# Altium project PowerMain_Ver0.1.PrjPcb
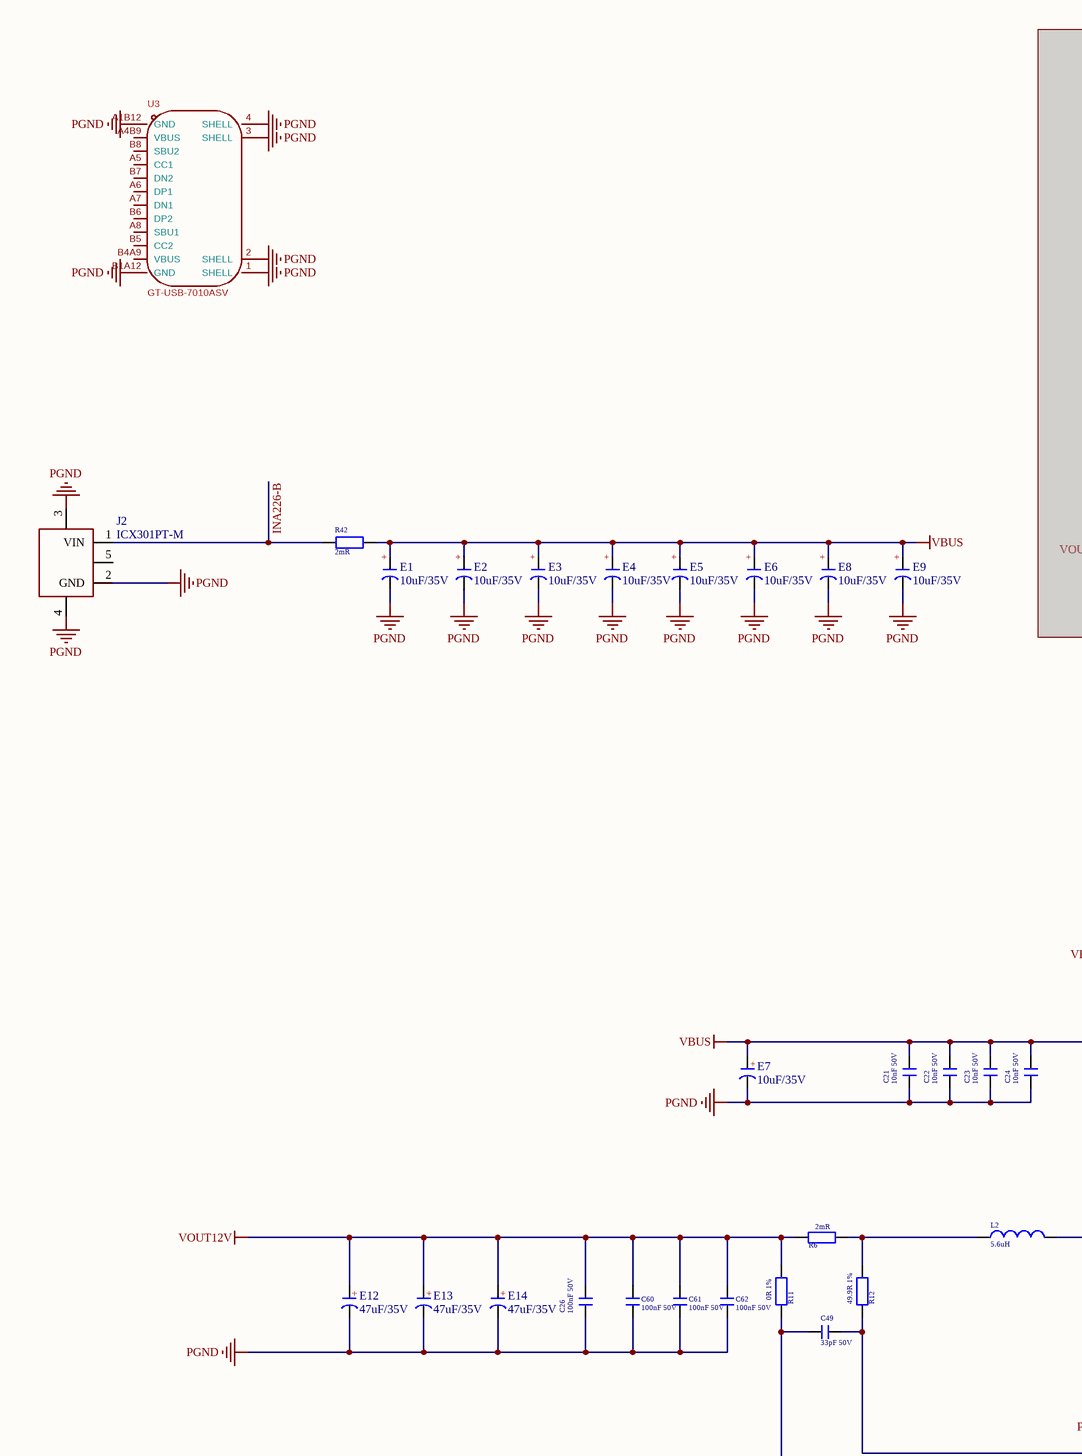
[diagram p0: LM5143.SchDoc, top left]
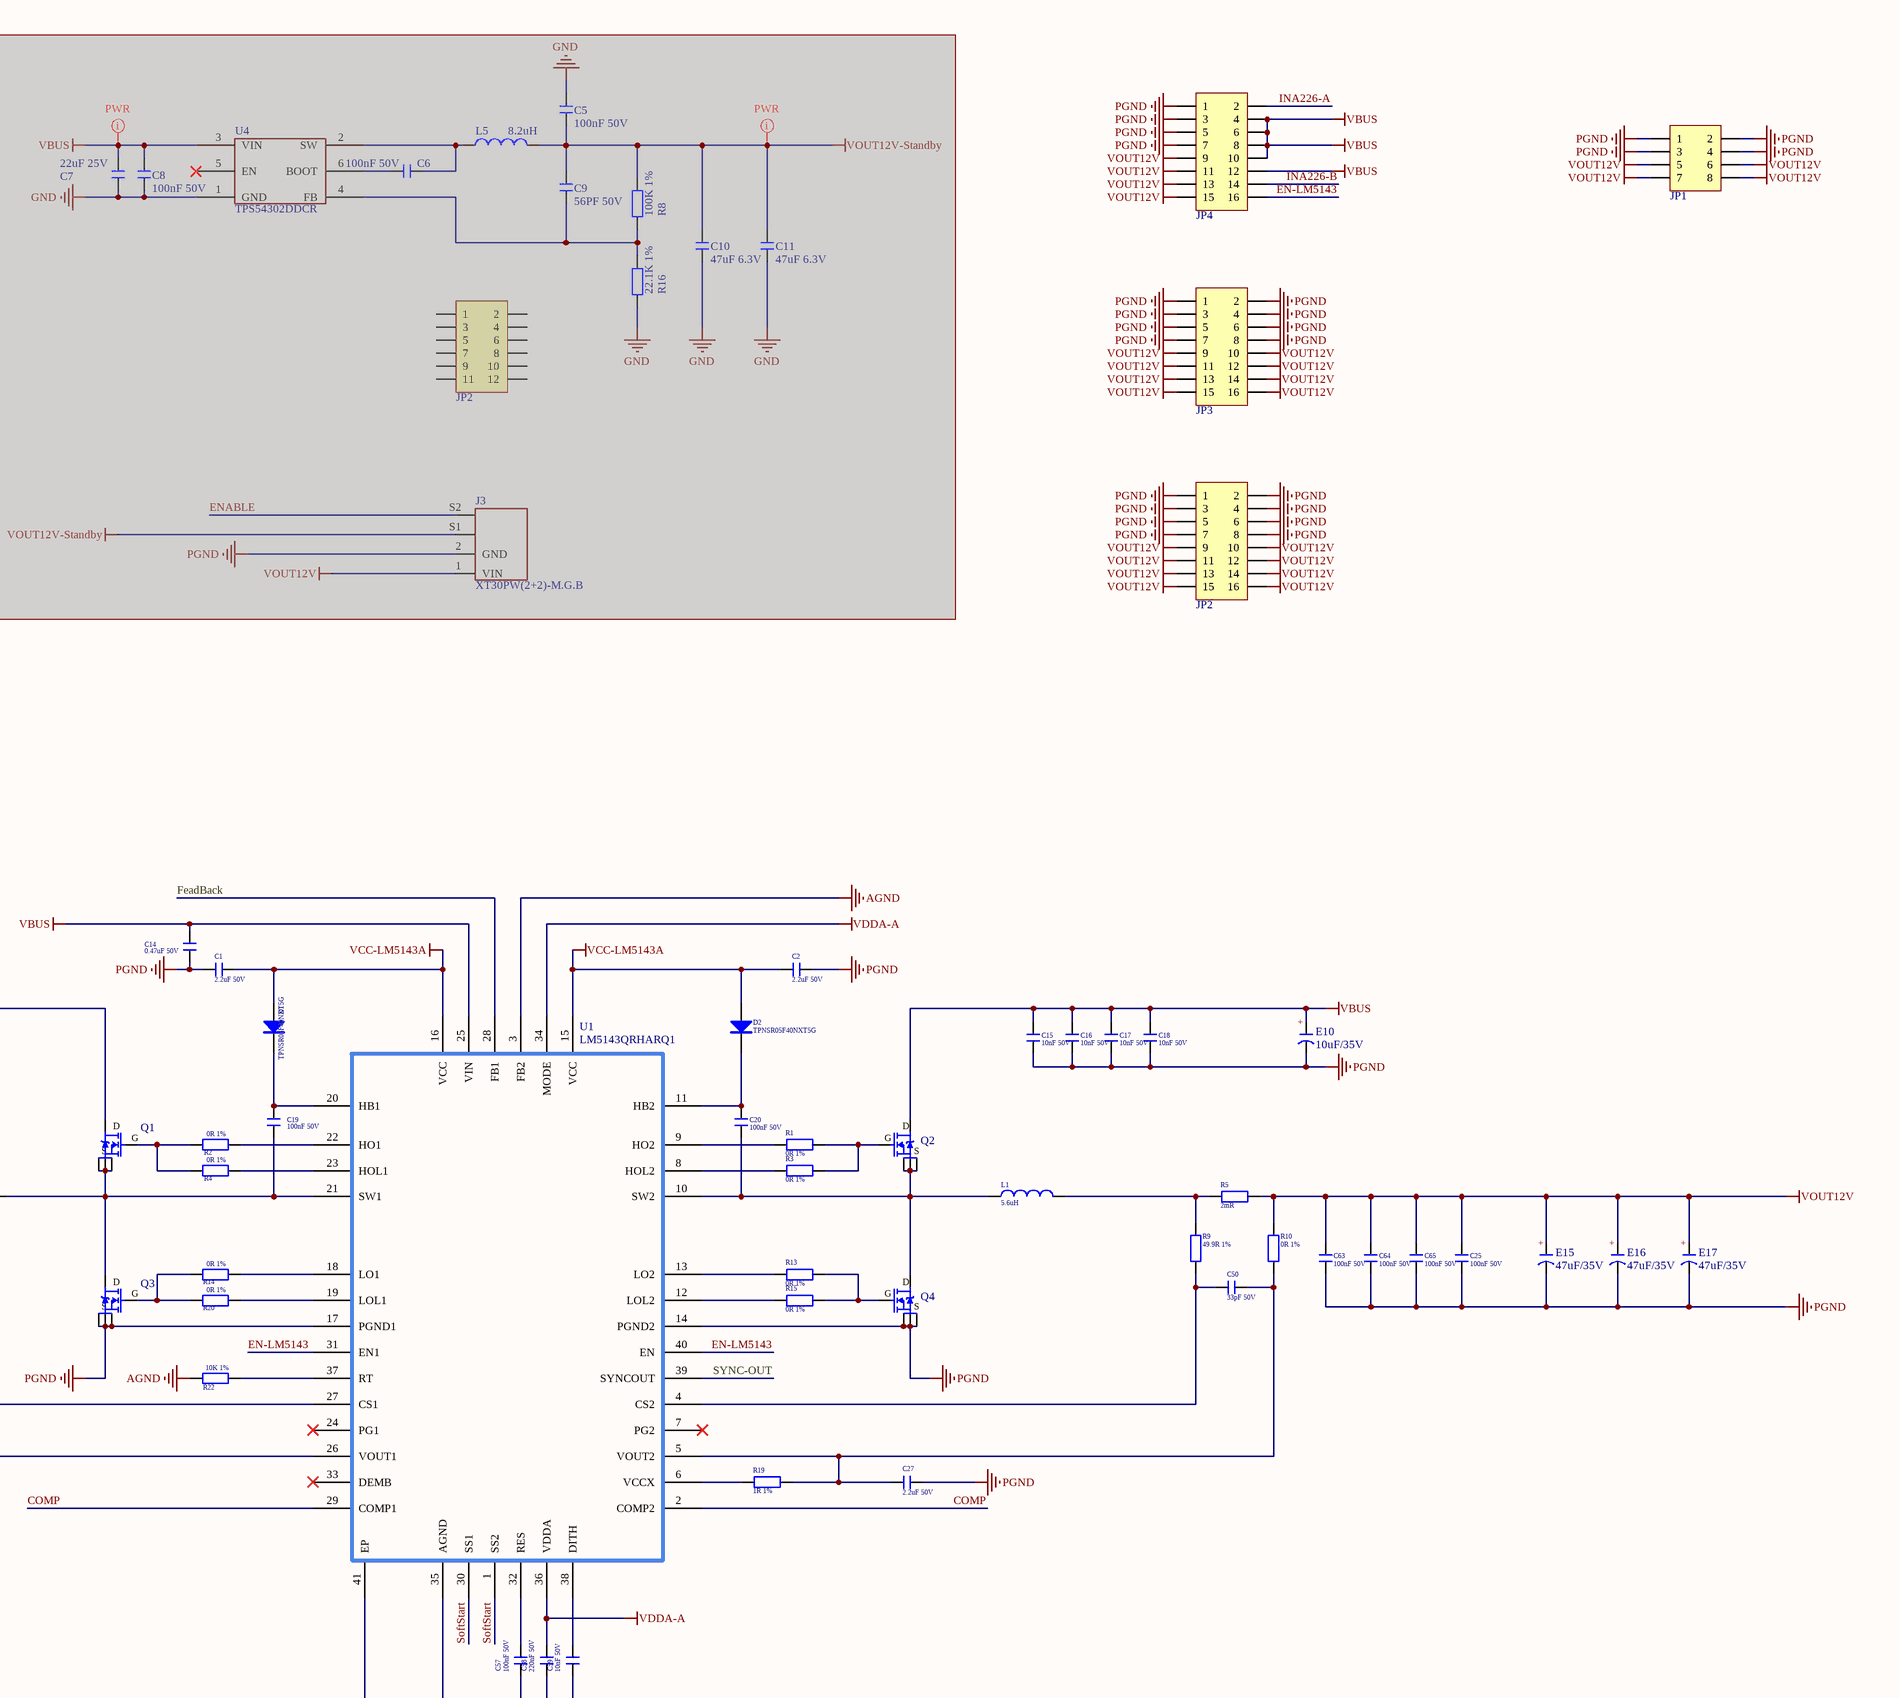
[diagram p1: LM5143.SchDoc, top right]
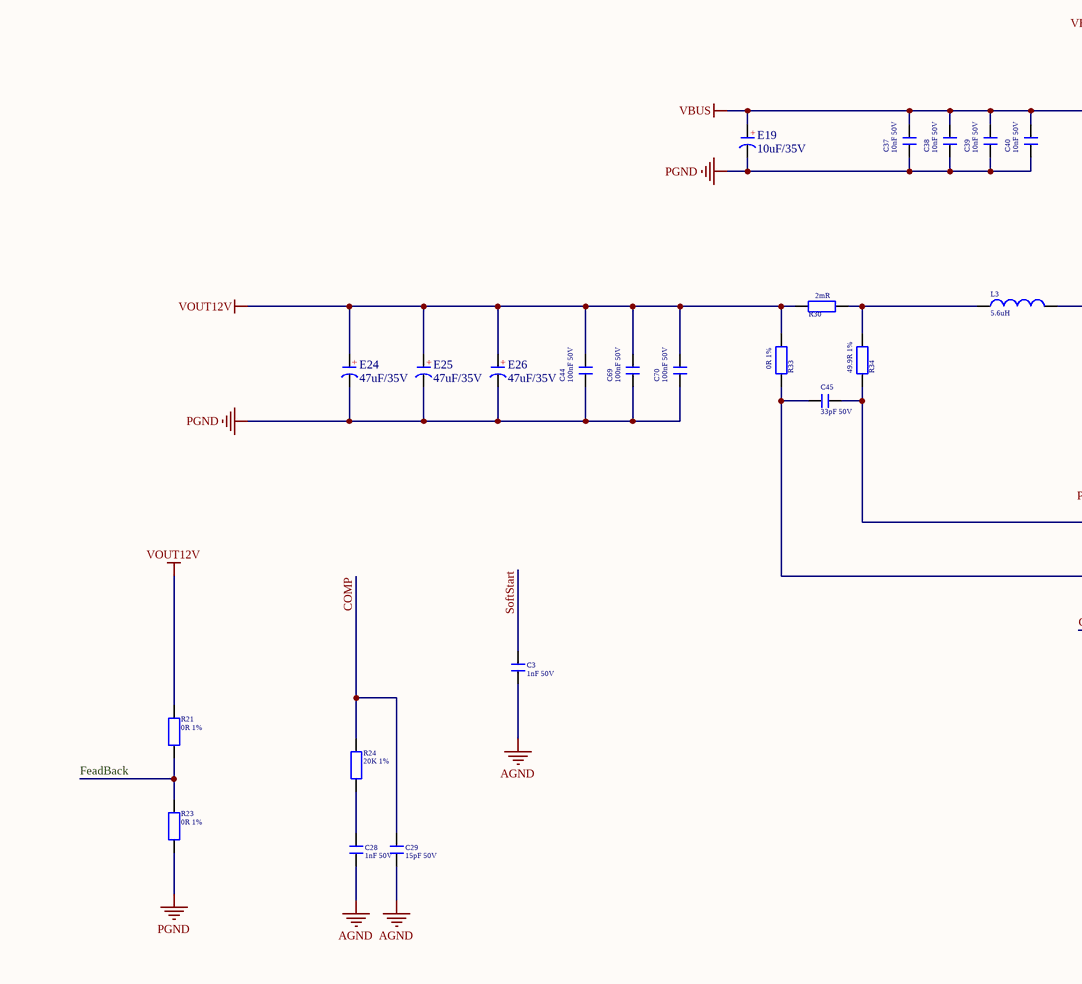
[diagram p2: LM5143.SchDoc, bottom left]
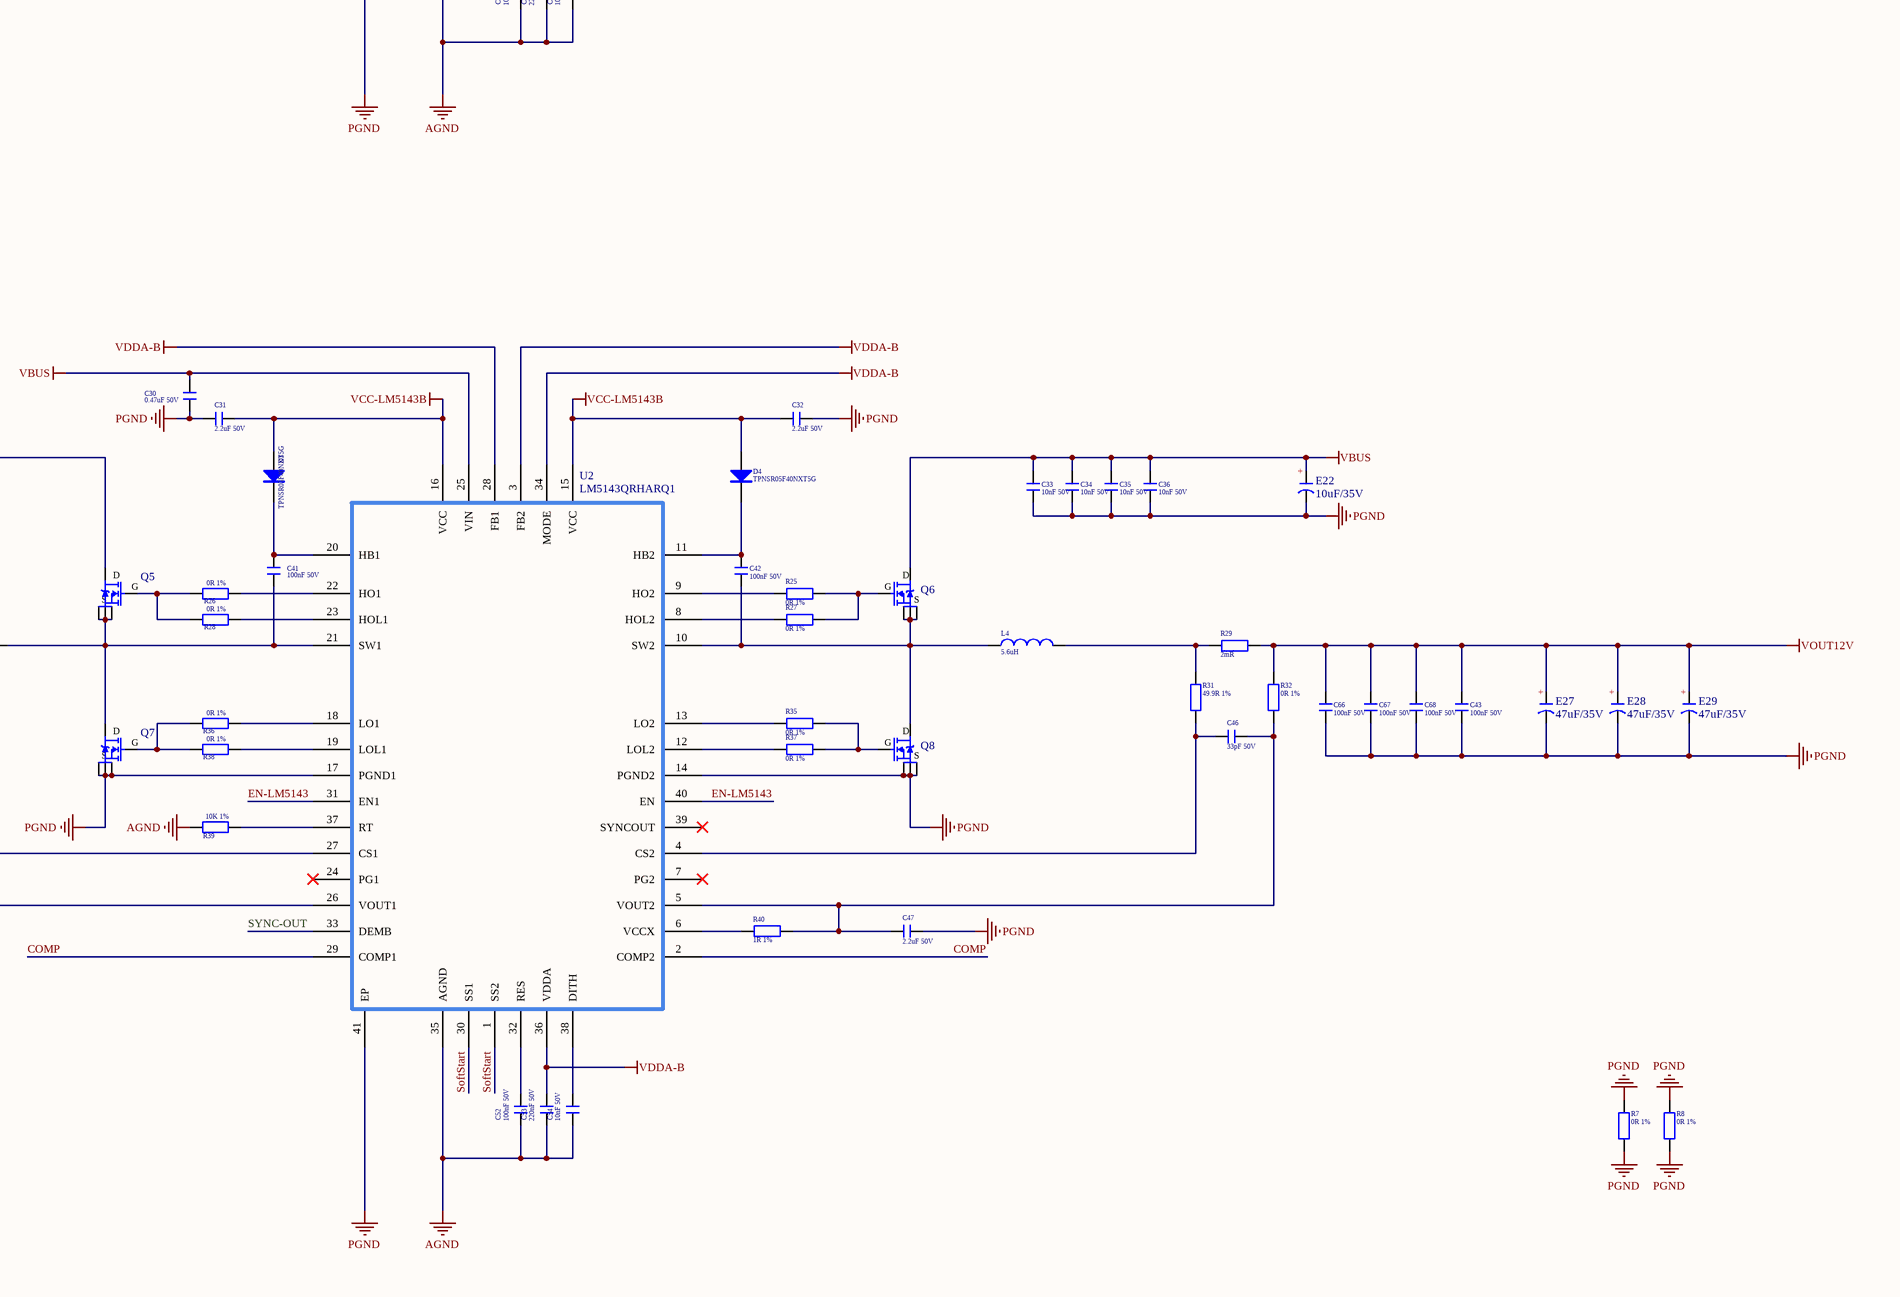
[diagram p3: LM5143.SchDoc, bottom right]
2 sheets, 155 parts. Net scope: global (net labels, ports and power ports of the same name join across sheets).
Board file: PCB.PcbDoc
Sheets:
  LM5143.SchDoc
  Sheet2.SchDoc

## Sheet LM5143.SchDoc
size 599 x 599 mm; SheetNumber: 1; SheetTotal: 2

### Parts
(Parts that share a designator on the sheet are numbered #1, #2 ... from top to bottom, then left to right.)
C1  2.2uF 50V  [C0402_l]
C2  2.2uF 50V  [C0402_l]
C3  1nF 50V  [C 0402_L]
C5  100nF 50V  [C0402_L]  (masked out: inside a compile mask, not in the netlist)
C6  100nF 50V  [C0402_L]  (masked out: inside a compile mask, not in the netlist)
C7  22uF 25V  [C0805_L]  (masked out: inside a compile mask, not in the netlist)
C8  100nF 50V  [C0402_L]  (masked out: inside a compile mask, not in the netlist)
C9  56PF 50V  [C0402_L]  (masked out: inside a compile mask, not in the netlist)
C10  47uF 6.3V  [C0805_L]  (masked out: inside a compile mask, not in the netlist)
C11  47uF 6.3V  [C0805_L]  (masked out: inside a compile mask, not in the netlist)
C14  0.47uF 50V  [C0402_l]
C15  10nF 50V  [C0603_l]
C16  10nF 50V  [C0603_l]
C17  10nF 50V  [C0603_l]
C18  10nF 50V  [C0603_l]
C19  100nF 50V  [C 0402_L]
C20  100nF 50V  [C 0402_L]
C21  10nF 50V  [C0603_l]
C22  10nF 50V  [C0603_l]
C23  10nF 50V  [C0603_l]
C24  10nF 50V  [C0603_l]
C25  100nF 50V  [C0402_l]
C26  100nF 50V  [C0603_l]
C27  2.2uF 50V  [C 0402_L]
C28  1nF 50V  [C 0402_L]
C29  15pF 50V  [C 0402_L]
C30  0.47uF 50V  [C0402_l]
C31  2.2uF 50V  [C0402_l]
C32  2.2uF 50V  [C0402_l]
C33  10nF 50V  [C0603_l]
C34  10nF 50V  [C0603_l]
C35  10nF 50V  [C0603_l]
C36  10nF 50V  [C0603_l]
C37  10nF 50V  [C0603_l]
C38  10nF 50V  [C0603_l]
C39  10nF 50V  [C0603_l]
C40  10nF 50V  [C0603_l]
C41  100nF 50V  [C 0402_L]
C42  100nF 50V  [C 0402_L]
C43  100nF 50V  [C0603_l]
C44  100nF 50V  [C0603_l]
C45  33pF 50V  [C0402_l]
C46  33pF 50V  [C0402_l]
C47  2.2uF 50V  [C 0402_L]
C49  33pF 50V  [C0402_l]
C50  33pF 50V  [C0402_l]
C52  100nF 50V  [C0402_l]
C53  220nF 50V  [C0402_l]
C54  10nF 50V  [C0402_l]
C57  100nF 50V  [C0402_l]
C58  220nF 50V  [C0402_l]
C59  10nF 50V  [C0402_l]
C60  100nF 50V  [C0603_l]
C61  100nF 50V  [C0402_l]
C62  100nF 50V  [C0603_l]
C63  100nF 50V  [C0603_l]
C64  100nF 50V  [C0603_l]
C65  100nF 50V  [C0603_l]
C66  100nF 50V  [C0402_l]
C67  100nF 50V  [C0402_l]
C68  100nF 50V  [C0603_l]
C69  100nF 50V  [C0603_l]
C70  100nF 50V  [C0603_l]
D1  TPNSR05F40NXT5G  [R0402_l]
D2  TPNSR05F40NXT5G  [R0402_l]
D3  TPNSR05F40NXT5G  [R0402_l]
D4  TPNSR05F40NXT5G  [R0402_l]
E1  10uF/35V  [CT 6*6 - V]
E2  10uF/35V  [CT 6*6 - V]
E3  10uF/35V  [CT 6*6 - V]
E4  10uF/35V  [CT 6*6 - V]
E5  10uF/35V  [CT 6*6 - V]
E6  10uF/35V  [CT 6*6 - V]
E7  10uF/35V  [CT 6*6 - V]
E8  10uF/35V  [CT 6*6 - V]
E9  10uF/35V  [CT 6*6 - V]
E10  10uF/35V  [CT 6*6 - V]
E12  47uF/35V  [CT 6*6 - V]
E13  47uF/35V  [CT 6*6 - V]
E14  47uF/35V  [CT 6*6 - V]
E15  47uF/35V  [CT 6*6 - V]
E16  47uF/35V  [CT 6*6 - V]
E17  47uF/35V  [CT 6*6 - V]
E19  10uF/35V  [CT 6*6 - V]
E22  10uF/35V  [CT 6*6 - V]
E24  47uF/35V  [CT 6*6 - V]
E25  47uF/35V  [CT 6*6 - V]
E26  47uF/35V  [CT 6*6 - V]
E27  47uF/35V  [CT 6*6 - V]
E28  47uF/35V  [CT 6*6 - V]
E29  47uF/35V  [CT 6*6 - V]
J2  ICX301PT-M  [CONN-SMD_ICX301PT-M]
J3  XT30PW(2+2)-M.G.B  [AMASS_XT30PW(2+2)-M.G.B]  (masked out: inside a compile mask, not in the netlist)
JP1  Header 4X2  [4.2mm 8Pin 贴片焊盘]  (value not drawn)
JP2#1  Header 6X2  [AMPHENOL_10164279-124121LF]  (value not drawn)  (masked out: inside a compile mask, not in the netlist)
JP2#2  Header 8X2  [HDR2.54-M-LS-2x8P]  (value not drawn)
JP3  Header 8X2  [HDR2.54-M-LS-2x8P]  (value not drawn)
JP4  Header 8X2  [HDR2.54-M-LS-2x8P]  (value not drawn)
L1  5.6uH  [ECI-IN-OP002 Indoctor]
L2  5.6uH  [ECI-IN-OP002 Indoctor]
L3  5.6uH  [ECI-IN-OP002 Indoctor]
L4  5.6uH  [ECI-IN-OP002 Indoctor]
L5  8.2uH  [L0630贴片电感]  (masked out: inside a compile mask, not in the netlist)
Q1  Nmos_DFN8_5*6  [DFN8_5*6]  (value not drawn)
Q2  Nmos_DFN8_5*6  [DFN8_5*6]  (value not drawn)
Q3  Nmos_DFN8_5*6  [DFN8_5*6]  (value not drawn)
Q4  Nmos_DFN8_5*6  [DFN8_5*6]  (value not drawn)
Q5  Nmos_DFN8_5*6  [DFN8_5*6]  (value not drawn)
Q6  Nmos_DFN8_5*6  [DFN8_5*6]  (value not drawn)
Q7  Nmos_DFN8_5*6  [DFN8_5*6]  (value not drawn)
Q8  Nmos_DFN8_5*6  [DFN8_5*6]  (value not drawn)
R1  0R 1%  [R 0402_L]
R2  0R 1%  [R 0402_L]
R3  0R 1%  [R 0402_L]
R4  0R 1%  [R 0402_L]
R5  2mR  [R 2512_L]
R6  2mR  [R 2512_L]
R7  0R 1%  [固定铜块]
R8#1  100K 1%  [R0402_L]  (masked out: inside a compile mask, not in the netlist)
R8#2  0R 1%  [固定铜块]
R9  49.9R 1%  [R 0402_L]
R10  0R 1%  [R 0402_L]
R11  0R 1%  [R 0402_L]
R12  49.9R 1%  [R 0402_L]
R13  0R 1%  [R 0402_L]
R14  0R 1%  [R 0402_L]
R15  0R 1%  [R 0402_L]
R16  22.1K 1%  [R0402_L]  (masked out: inside a compile mask, not in the netlist)
R19  1R 1%  [R 0402_L]
R20  0R 1%  [R 0402_L]
R21  0R 1%  [R 0402_L]
R22  10K 1%  [R 0402_L]
R23  0R 1%  [R 0402_L]
R24  20K 1%  [R 0402_L]
R25  0R 1%  [R 0402_L]
R26  0R 1%  [R 0402_L]
R27  0R 1%  [R 0402_L]
R28  0R 1%  [R 0402_L]
R29  2mR  [R 2512_L]
R30  2mR  [R 2512_L]
R31  49.9R 1%  [R 0402_L]
R32  0R 1%  [R 0402_L]
R33  0R 1%  [R 0402_L]
R34  49.9R 1%  [R 0402_L]
R35  0R 1%  [R 0402_L]
R36  0R 1%  [R 0402_L]
R37  0R 1%  [R 0402_L]
R38  0R 1%  [R 0402_L]
R39  10K 1%  [R 0402_L]
R40  1R 1%  [R 0402_L]
R42  2mR  [R 2512_L]
U1  LM5143QRHARQ1  [QFN40 6X6_M]
U2  LM5143QRHARQ1  [QFN40 6X6_M]
U3  GT-USB-7010ASV  [USB-C-SMD_G-SWITCH_GT-USB-7010ASV]
U4  TPS54302DDCR  [SOT23-6L]  (masked out: inside a compile mask, not in the netlist)

### Nets
AGND: C3.2 C28.2 C29.2 C52.1 C53.1 C54.1 C57.1 C58.1 C59.1 R22.1 R39.1 U1.3(FB2) U1.35(AGND) U2.35(AGND)
PGND: C1.1 C2.1 C14.1 C15.1 C16.1 C17.1 C18.1 C21.1 C22.1 C23.1 C24.1 C25.1 C26.1 C27.1 C30.1 C31.1 C32.1 C33.1 C34.1 C35.1 C36.1 C37.1 C38.1 C39.1 C40.1 C43.1 C44.1 C47.1 C60.1 C61.1 C62.1 C63.1 C64.1 C65.1 C66.1 C67.1 C68.1 C69.1 C70.1 E1.2(K) E2.2(K) E3.2(K) E4.2(K) E5.2(K) E6.2(K) E7.2(K) E8.2(K) E9.2(K) E10.2(K) E12.2(K) E13.2(K) E14.2(K) E15.2(K) E16.2(K) E17.2(K) E19.2(K) E22.2(K) E24.2(K) E25.2(K) E26.2(K) E27.2(K) E28.2(K) E29.2(K) J2.2(GND) J2.3 J2.4 JP1.1 JP1.2 JP1.3 JP1.4 JP2#2.1 JP2#2.2 JP2#2.3 JP2#2.4 JP2#2.5 JP2#2.6 JP2#2.7 JP2#2.8 JP3.1 JP3.2 JP3.3 JP3.4 JP3.5 JP3.6 JP3.7 JP3.8 JP4.1 JP4.3 JP4.5 JP4.7 Q3.1(S) Q3.2(S) Q3.3(S) Q4.1(S) Q4.2(S) Q4.3(S) Q7.1(S) Q7.2(S) Q7.3(S) Q8.1(S) Q8.2(S) Q8.3(S) R7.1 R7.2 R8#2.1 R8#2.2 R23.1 U1.14(PGND2) U1.17(PGND1) U1.41(EP) U2.14(PGND2) U2.17(PGND1) U2.41(EP) U3.1(SHELL) U3.2(SHELL) U3.3(SHELL) U3.4(SHELL) U3.A1B12(GND) U3.B1A12(GND)
VBUS: C14.2 C15.2 C16.2 C17.2 C18.2 C21.2 C22.2 C23.2 C24.2 C30.2 C33.2 C34.2 C35.2 C36.2 C37.2 C38.2 C39.2 C40.2 E1.1(A) E2.1(A) E3.1(A) E4.1(A) E5.1(A) E6.1(A) E7.1(A) E8.1(A) E9.1(A) E10.1(A) E19.1(A) E22.1(A) JP4.4 JP4.6 JP4.8 JP4.10 JP4.12 Q1.5(D) Q2.5(D) Q5.5(D) Q6.5(D) R42.2 U1.25(VIN) U2.25(VIN)
VCC-LM5143A: C1.2 C2.2 D1.1(A) D2.1(A) U1.15(VCC) U1.16(VCC)
VCC-LM5143B: C31.2 C32.2 D3.1(A) D4.1(A) U2.15(VCC) U2.16(VCC)
VDDA-A: C58.2 U1.34(MODE) U1.36(VDDA)
VDDA-B: C53.2 U2.3(FB2) U2.28(FB1) U2.34(MODE) U2.36(VDDA)
VOUT12V: C25.2 C26.2 C43.2 C44.2 C60.2 C61.2 C62.2 C63.2 C64.2 C65.2 C66.2 C67.2 C68.2 C69.2 C70.2 E12.1(A) E13.1(A) E14.1(A) E15.1(A) E16.1(A) E17.1(A) E24.1(A) E25.1(A) E26.1(A) E27.1(A) E28.1(A) E29.1(A) JP1.5 JP1.6 JP1.7 JP1.8 JP2#2.9 JP2#2.10 JP2#2.11 JP2#2.12 JP2#2.13 JP2#2.14 JP2#2.15 JP2#2.16 JP3.9 JP3.10 JP3.11 JP3.12 JP3.13 JP3.14 JP3.15 JP3.16 JP4.9 JP4.11 JP4.13 JP4.15 R5.2 R6.2 R10.2 R11.2 R21.2 R29.2 R30.2 R32.2 R33.2
COMP: C29.1 R24.2 U1.2(COMP2) U1.29(COMP1) U2.2(COMP2) U2.29(COMP1)
EN-LM5143: JP4.16 U1.31(EN1) U1.40(EN) U2.31(EN1) U2.40(EN)
FeadBack: R21.1 R23.2 U1.28(FB1)
INA226-A: JP4.2
INA226-B: J2.1(VIN) JP4.14 R42.1
SoftStart: C3.1 U1.1(SS2) U1.30(SS1) U2.1(SS2) U2.30(SS1)
SYNC-OUT: U1.39(SYNCOUT) U2.33(DEMB)
NetC19_1: C19.1 L2.2 Q1.1(S) Q1.2(S) Q1.3(S) Q3.5(D) U1.21(SW1)
NetC19_2: C19.2 D1.2(K) U1.20(HB1)
NetC20_1: C20.1 L1.1 Q2.1(S) Q2.2(S) Q2.3(S) Q4.5(D) U1.10(SW2)
NetC20_2: C20.2 D2.2(K) U1.11(HB2)
NetC27_2: C27.2 C50.2 R10.1 R19.1 U1.5(VOUT2)
NetC28_1: C28.1 R24.1
NetC41_1: C41.1 L3.2 Q5.1(S) Q5.2(S) Q5.3(S) Q7.5(D) U2.21(SW1)
NetC41_2: C41.2 D3.2(K) U2.20(HB1)
NetC42_1: C42.1 L4.1 Q6.1(S) Q6.2(S) Q6.3(S) Q8.5(D) U2.10(SW2)
NetC42_2: C42.2 D4.2(K) U2.11(HB2)
NetC45_1: C45.1 R34.1 U2.27(CS1)
NetC45_2: C45.2 R33.1 U2.26(VOUT1)
NetC46_1: C46.1 R31.1 U2.4(CS2)
NetC46_2: C46.2 C47.2 R32.1 R40.1 U2.5(VOUT2)
NetC49_1: C49.1 R12.1 U1.27(CS1)
NetC49_2: C49.2 R11.1 U1.26(VOUT1)
NetC50_1: C50.1 R9.1 U1.4(CS2)
NetC52_2: C52.2 U2.32(RES)
NetC54_2: C54.2 U2.38(DITH)
NetC57_2: C57.2 U1.32(RES)
NetC59_2: C59.2 U1.38(DITH)
NetL1_2: L1.2 R5.1 R9.2
NetL2_1: L2.1 R6.1 R12.2
NetL3_1: L3.1 R30.1 R34.2
NetL4_2: L4.2 R29.1 R31.2
NetQ1_4: Q1.4(G) R2.1 R4.1
NetQ2_4: Q2.4(G) R1.1 R3.1
NetQ3_4: Q3.4(G) R14.1 R20.1
NetQ4_4: Q4.4(G) R13.1 R15.1
NetQ5_4: Q5.4(G) R26.1 R28.1
NetQ6_4: Q6.4(G) R25.1 R27.1
NetQ7_4: Q7.4(G) R36.1 R38.1
NetQ8_4: Q8.4(G) R35.1 R37.1
NetR1_2: R1.2 U1.9(HO2)
NetR2_2: R2.2 U1.22(HO1)
NetR3_2: R3.2 U1.8(HOL2)
NetR4_2: R4.2 U1.23(HOL1)
NetR13_2: R13.2 U1.13(LO2)
NetR14_2: R14.2 U1.18(LO1)
NetR15_2: R15.2 U1.12(LOL2)
NetR19_2: R19.2 U1.6(VCCX)
NetR20_2: R20.2 U1.19(LOL1)
NetR22_2: R22.2 U1.37(RT)
NetR25_2: R25.2 U2.9(HO2)
NetR26_2: R26.2 U2.22(HO1)
NetR27_2: R27.2 U2.8(HOL2)
NetR28_2: R28.2 U2.23(HOL1)
NetR35_2: R35.2 U2.13(LO2)
NetR36_2: R36.2 U2.18(LO1)
NetR37_2: R37.2 U2.12(LOL2)
NetR38_2: R38.2 U2.19(LOL1)
NetR39_2: R39.2 U2.37(RT)
NetR40_2: R40.2 U2.6(VCCX)

Not connected (* = marked no-connect by the designer): J2 5; U1 7(PG2)* 24(PG1)* 33(DEMB)*; U2 7(PG2)* 24(PG1)* 39(SYNCOUT)*; U3 A4B9(VBUS) A5(CC1) A6(DP1) A7(DN1) A8(SBU1) B4A9(VBUS) B5(CC2) B6(DP2) B7(DN2) B8(SBU2)

### Layout directives
net class PWR: (no net found under the mark)

### Notes on the sheet
- (in symbol C-CAP) +

### Library data of the parts
C1-C3 C5-C11 C14-C47 C49 C50 C52-C54 C57-C70 = C: 无极性贴片电容; 版权归属: 源创客; 材质: X7R; BOM名称: 无极性贴片电容; 学习资源: www.ooocke.com
D1-D4 = 1N4148: 高速开关二极管; 版权归属: 源创客; BOM名称: 高速开关二极管; 学习资源: www.ooocke.com
E1-E10 E12-E17 E19 E22 E24-E29 = C-CAP: 直插电解电容; 版权归属: 源创客; BOM名称: 直插电解电容; 学习资源: www.ooocke.com
JP1 = Header 4X2: 4*2P接插件; 版权归属: 源创客; BOM名称: 4*2P接插件; 学习资源: www.ooocke.com
JP2#1 = Header  6X2: 6*2P接插件; 版权归属: 源创客; BOM名称: 6*2P接插件; 学习资源: www.ooocke.com
JP2#2 JP3 JP4 = Header 8X2: 8*2P接插件; 版权归属: 源创客; BOM名称: 8*2P接插件; 学习资源: www.ooocke.com
L1-L5 = L: 小功率贴片电感; 版权归属: 源创客; BOM名称: 小功率贴片电感; 学习资源: www.ooocke.com
Q1-Q8 = Nmos_DFN8_5*6: BOM名称: 场效应管; 版权归属: 源创客; 描述: P沟道 30V/4.2A; 学习资源: www.ooocke.com
R1-R7 R8#1 R8#2 R9-R16 R19-R40 R42 = R: 贴片电阻; 版权归属: 源创客; BOM名称: 贴片电阻; 学习资源: www.ooocke.com
U1 U2 = LM5143QRHARQ1: DCDC-Buck控制器
U3 = GT-USB-7010ASV: 连接器类型:Type-C;标准:USB 2.0;公母:母;安装方式:卧贴;触点数量:16P;端口数量:1;额定电流 - 电源:3A;工作温度范围:-40℃~+85℃;; Manufacturer: G-Switch(品赞); AddInBom: yes; ModelId: f185ae662725428a9073ef0181ffed89聨0819f05c4eef4c71ace90d822a990e87; ModelTransform: 351.9678,311.023,0,0,0,0,0,-41.339,-59.055; Connector Type: Type-C; Gender: 母; Number of Contacts: 16P; Number of Ports: 1; Current Rating - Power (Max): 3A; Rated Voltage (Max): 24V; Connect-Disconnect Life: 1万次; Center Height: 1.68mm; Core Colour: 黑色; Symbol: GT-USB-7010ASV; Device: GT-USB-7010ASV; LCSC Part Name: Type-C 母 卧贴; SupplierPart: C2988369; ManufacturerPart: GT-USB-7010ASV; Supplier Footprint: SMD; JLCPCB Part Class: Extended Part; Datasheet: https://atta.szlcsc.com/upload/public/pdf/source/20230327/DF227B64686AC8FA0AD1775797F2C3F1.pdf; Supplier: LCSC; ConvertToPcb: yes; FootprintName: USB-C-SMD_G-SWITCH_GT-USB-7010ASV; ModelName: USB-C-SMD_G-SWITCH_GT-USB-7010ASV; Standard: USB 2.0; Mounting Style: 卧贴; Length: 7.35mm; Operating Temperature Range: -40℃~+85℃
U4 = TPS54202DDCR: DCDC Convert

## Sheet Sheet2.SchDoc
size A4; SheetNumber: 2; SheetTotal: 2
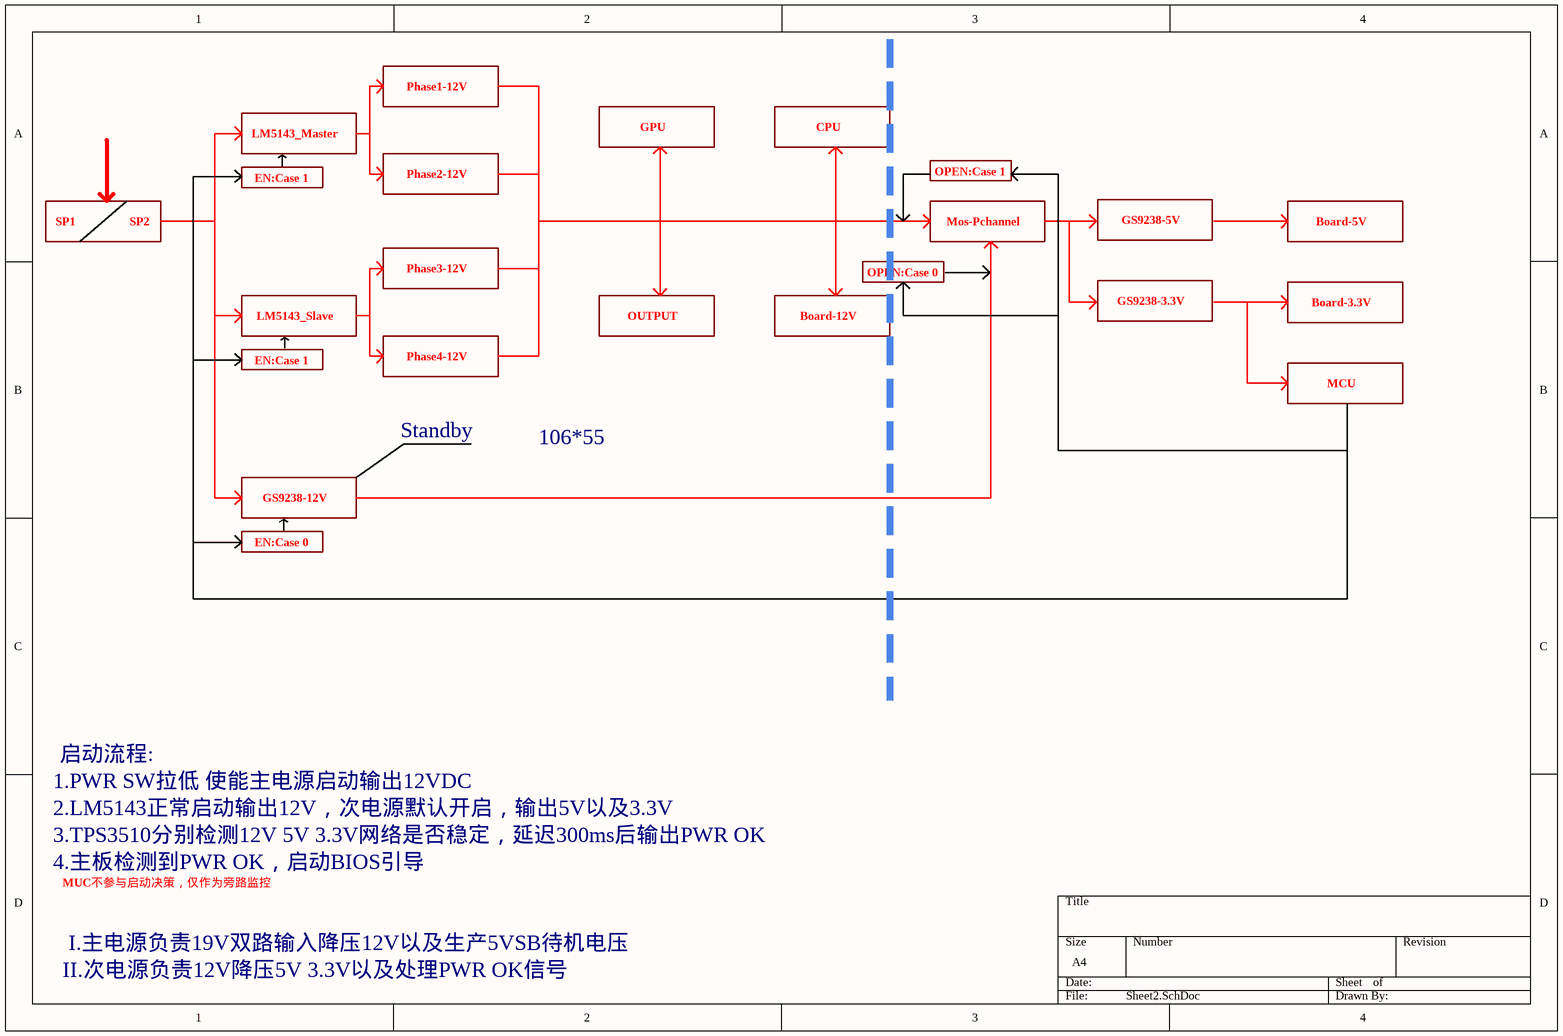
[diagram p4: Sheet2.SchDoc]

### Notes on the sheet
- Phase1-12V
- EN:Case 1
- LM5143_Master
- Phase2-12V
- GPU
- CPU
- OPEN:Case 1
- SP1
- SP2
- Mos-Pchannel
- GS9238-5V
- Board-5V
- LM5143_Slave
- Phase3-12V
- OUTPUT
- Board-12V
- OPEN:Case 0
- GS9238-3.3V
- Board-3.3V
- Phase4-12V
- MCU
- Standby
- 106*55
- GS9238-12V
- EN:Case 0
- 1.PWR SW拉低 使能主电源启动输出12VDC
- 启动流程:
- 2.LM5143正常启动输出12V，次电源默认开启，输出5V以及3.3V
- 3.TPS3510分别检测12V 5V 3.3V网络是否稳定，延迟300ms后输出PWR OK
- 4.主板检测到PWR OK，启动BIOS引导
- MUC不参与启动决策，仅作为旁路监控
- II.次电源负责12V降压5V 3.3V以及处理PWR OK信号
- I.主电源负责19V双路输入降压12V以及生产5VSB待机电压